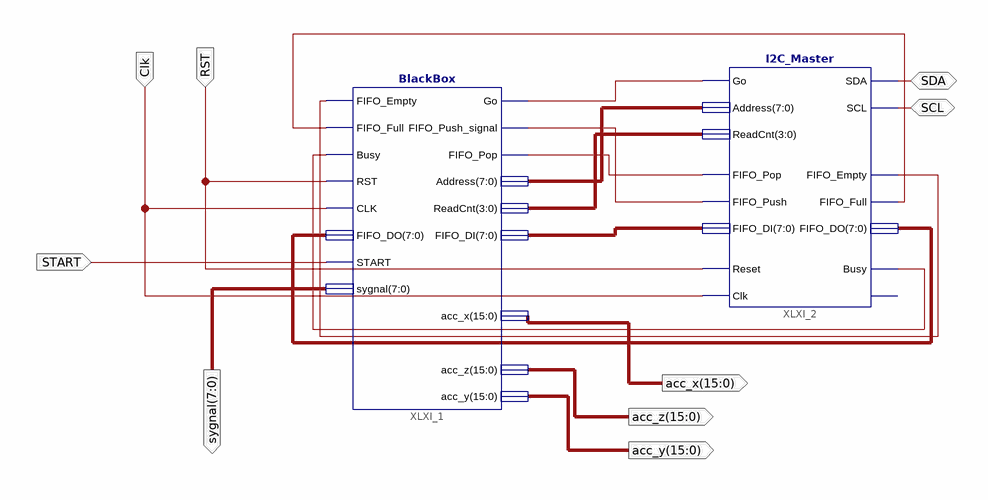
[diagram p0: schematic sheet 1]
// Xilinx ISE schematic i2c_use.sch (artix7) as structural Verilog: 2 symbols, 9 ports
module i2c_use (
  input  RST,
  input  Clk,
  input  START,
  inout  SDA,
  inout  SCL,
  output [7:0] sygnal,
  output [15:0] acc_x,
  output [15:0] acc_z,
  output [15:0] acc_y
);

  wire XLXN_2, XLXN_3, XLXN_4, XLXN_11, XLXN_12, XLXN_13;
  wire [3:0] XLXN_6;
  wire [7:0] XLXN_5, XLXN_7, XLXN_10;

  BlackBox XLXI_1 (
    .FIFO_Empty(XLXN_12), .FIFO_Full(XLXN_11), .Busy(XLXN_13), .RST(RST), .CLK(Clk), .START(START),
    .FIFO_DO(XLXN_10), .Go(XLXN_2), .FIFO_Push_signal(XLXN_3), .FIFO_Pop(XLXN_4), .Address(XLXN_5),
    .ReadCnt(XLXN_6), .FIFO_DI(XLXN_7), .sygnal(sygnal), .acc_x(acc_x), .acc_z(acc_z), .acc_y(acc_y));
  I2C_Master XLXI_2 (
    .Go(XLXN_2), .Address(XLXN_5), .ReadCnt(XLXN_6), .SDA(SDA), .SCL(SCL), .FIFO_Pop(XLXN_4),
    .FIFO_Push(XLXN_3), .FIFO_DI(XLXN_7), .FIFO_Empty(XLXN_12), .FIFO_Full(XLXN_11), .FIFO_DO(XLXN_10),
    .Reset(RST), .Clk(Clk), .Busy(XLXN_13));  // open: NACK
endmodule
